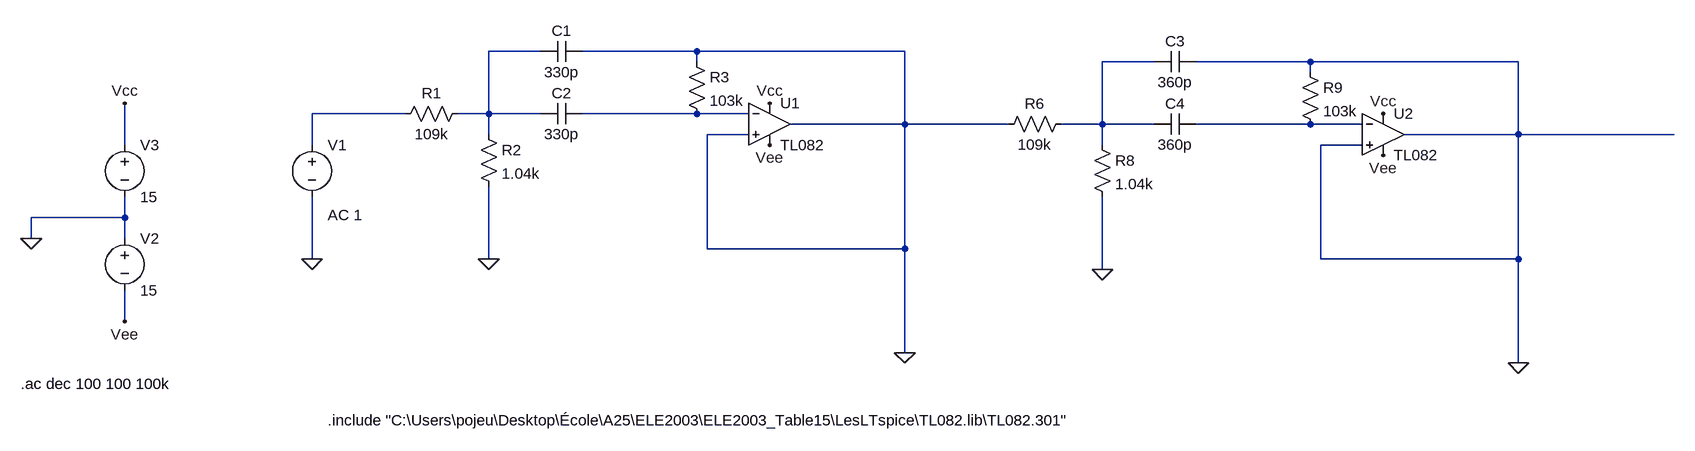
[diagram p0: schematic FilterWizard.asc]
FilterWizard.asc, the LTspice schematic file:
Version 4.1
SHEET 1 2068 680
WIRE 320 32 240 32
WIRE 560 32 384 32
WIRE 880 32 560 32
WIRE 560 48 560 32
WIRE 1264 48 1184 48
WIRE 1504 48 1328 48
WIRE 1824 48 1504 48
WIRE 1504 64 1504 48
WIRE 112 128 -32 128
WIRE 240 128 240 32
WIRE 240 128 192 128
WIRE 320 128 240 128
WIRE 560 128 384 128
WIRE 640 128 560 128
WIRE 880 144 880 32
WIRE 880 144 704 144
WIRE 1040 144 880 144
WIRE 1184 144 1184 48
WIRE 1184 144 1120 144
WIRE 1264 144 1184 144
WIRE 1504 144 1328 144
WIRE 1584 144 1504 144
WIRE 240 160 240 128
WIRE 640 160 576 160
WIRE 1824 160 1824 48
WIRE 1824 160 1648 160
WIRE 2064 160 1824 160
WIRE -320 176 -320 112
WIRE -32 176 -32 128
WIRE 1184 176 1184 144
WIRE 1584 176 1520 176
WIRE -320 288 -320 256
WIRE -320 288 -464 288
WIRE -464 320 -464 288
WIRE -320 320 -320 288
WIRE 576 336 576 160
WIRE 880 336 880 144
WIRE 880 336 576 336
WIRE -32 352 -32 256
WIRE 240 352 240 240
WIRE 1520 352 1520 176
WIRE 1824 352 1824 160
WIRE 1824 352 1520 352
WIRE 1184 368 1184 256
WIRE -320 448 -320 400
WIRE 880 496 880 336
WIRE 1824 512 1824 352
FLAG 880 496 0
FLAG 240 352 0
FLAG 1824 512 0
FLAG 1184 368 0
FLAG -320 448 Vee
FLAG 672 176 Vee
FLAG 1616 192 Vee
FLAG -320 112 Vcc
FLAG 672 112 Vcc
FLAG 1616 128 Vcc
FLAG -464 320 0
FLAG -32 352 0
SYMBOL res 96 144 R270
WINDOW 0 32 56 VTop 2
WINDOW 3 0 56 VBottom 2
SYMATTR InstName R1
SYMATTR Value 109k
SYMBOL res 224 144 R0
SYMATTR InstName R2
SYMATTR Value 1.04k
SYMBOL cap 384 16 R90
WINDOW 0 0 32 VBottom 2
WINDOW 3 32 32 VTop 2
SYMATTR InstName C1
SYMATTR Value 330p
SYMBOL cap 384 112 R90
WINDOW 0 0 32 VBottom 2
WINDOW 3 32 32 VTop 2
SYMATTR InstName C2
SYMATTR Value 330p
SYMBOL res 544 32 R0
SYMATTR InstName R3
SYMATTR Value 103k
SYMBOL OpAmps\\opamp2 672 80 R0
SYMATTR InstName U1
SYMATTR Value TL082
SYMBOL res 1136 128 R90
WINDOW 0 0 56 VBottom 2
WINDOW 3 32 56 VTop 2
SYMATTR InstName R6
SYMATTR Value 109k
SYMBOL res 1168 160 R0
SYMATTR InstName R8
SYMATTR Value 1.04k
SYMBOL cap 1328 32 R90
WINDOW 0 0 32 VBottom 2
WINDOW 3 32 32 VTop 2
SYMATTR InstName C3
SYMATTR Value 360p
SYMBOL cap 1328 128 R90
WINDOW 0 0 32 VBottom 2
WINDOW 3 32 32 VTop 2
SYMATTR InstName C4
SYMATTR Value 360p
SYMBOL res 1488 48 R0
SYMATTR InstName R9
SYMATTR Value 103k
SYMBOL OpAmps\\opamp2 1616 96 R0
SYMATTR InstName U2
SYMATTR Value TL082
SYMBOL voltage -32 160 R0
WINDOW 123 24 124 Left 2
WINDOW 39 0 0 Left 0
SYMATTR Value2 AC 1
SYMATTR InstName V1
SYMATTR Value ""
SYMBOL voltage -320 304 R0
SYMATTR InstName V2
SYMATTR Value 15
SYMBOL voltage -320 160 R0
SYMATTR InstName V3
SYMATTR Value 15
TEXT -480 544 Left 2 !.ac dec 100 100 100k
TEXT -8 600 Left 2 !.include "C:\\Users\\pojeu\\Desktop\\École\\A25\\ELE2003\\ELE2003_Table15\\LesLTspice\\TL082.lib\\TL082.301"

The netlist it stands for:
* FilterWizard.asc
R1 N003 N001 109k
R2 N001 0 1.04k
C1 0 N001 330p
C2 N004 N001 330p
R3 0 N004 103k
X§U1 0 N004 Vcc Vee 0 TL082  ; pins In+ In- V+ V- OUT
R6 N002 0 109k
R8 N002 0 1.04k
C3 0 N002 360p
C4 N005 N002 360p
R9 0 N005 103k
X§U2 0 N005 Vcc Vee 0 TL082  ; pins In+ In- V+ V- OUT
V1 N003 0 AC 1
V2 0 Vee 15
V3 Vcc 0 15
.ac dec 100 100 100k
.include "C:\Users\pojeu\Desktop\École\A25\ELE2003\ELE2003_Table15\LesLTspice\TL082.lib\TL082.301"
.backanno
.end